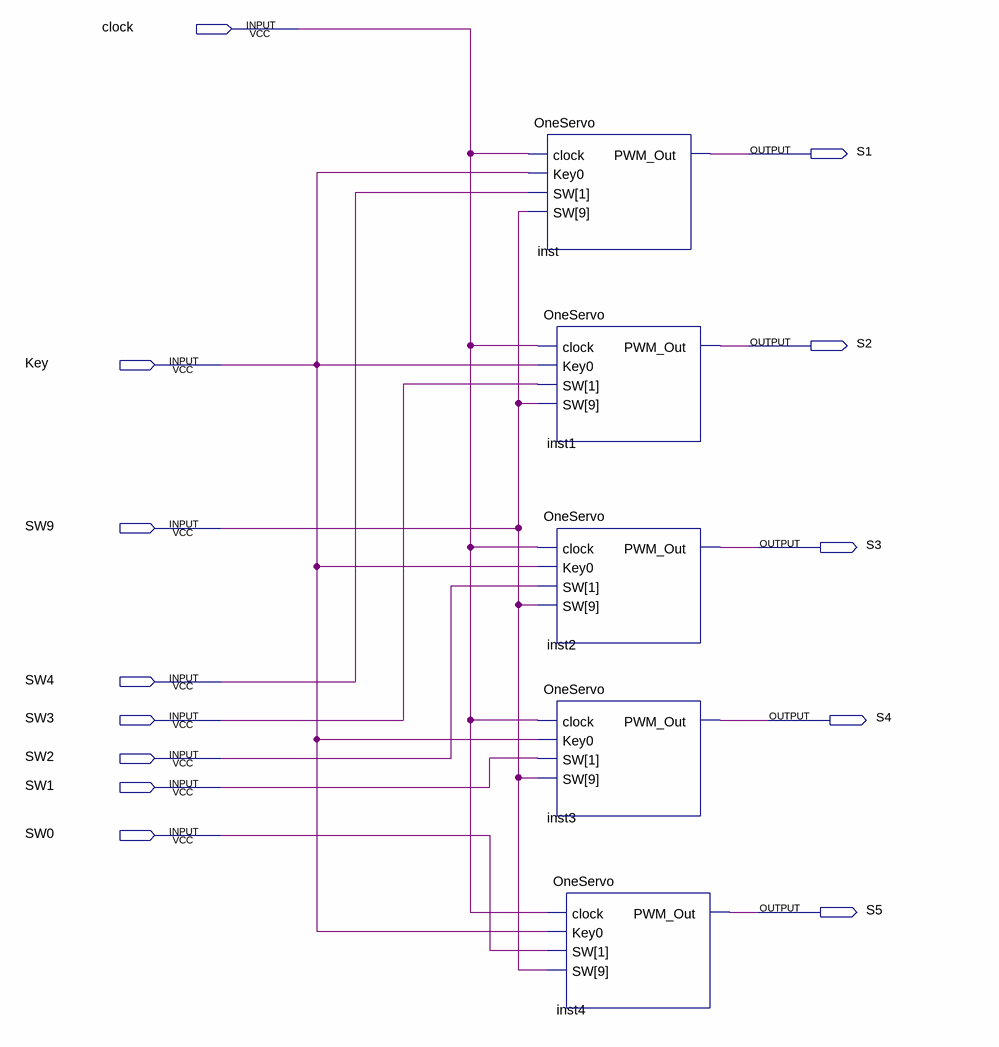
[diagram p0: schematic sheet]
// Quartus schematic AllServos.bdf as structural Verilog: 5 symbols, 13 pins
module AllServos (
  input  clock,
  input  Key,
  input  SW9,
  input  SW4,
  input  SW3,
  input  SW2,
  input  SW1,
  input  SW0,
  output S1,
  output S2,
  output S3,
  output S4,
  output S5
);

  OneServo inst (.clock(clock), .Key0(Key), .SW({SW9, SW4}), .PWM_Out(S1));
  OneServo inst1 (.clock(clock), .Key0(Key), .SW({SW9, SW3}), .PWM_Out(S2));
  OneServo inst2 (.clock(clock), .Key0(Key), .SW({SW9, SW2}), .PWM_Out(S3));
  OneServo inst3 (.clock(clock), .Key0(Key), .SW({SW9, SW1}), .PWM_Out(S4));
  OneServo inst4 (.clock(clock), .Key0(Key), .SW({SW9, SW0}), .PWM_Out(S5));
endmodule
